# EAGLE schematic THESIS SCHEMATIC (EAGLE 9.7.0)
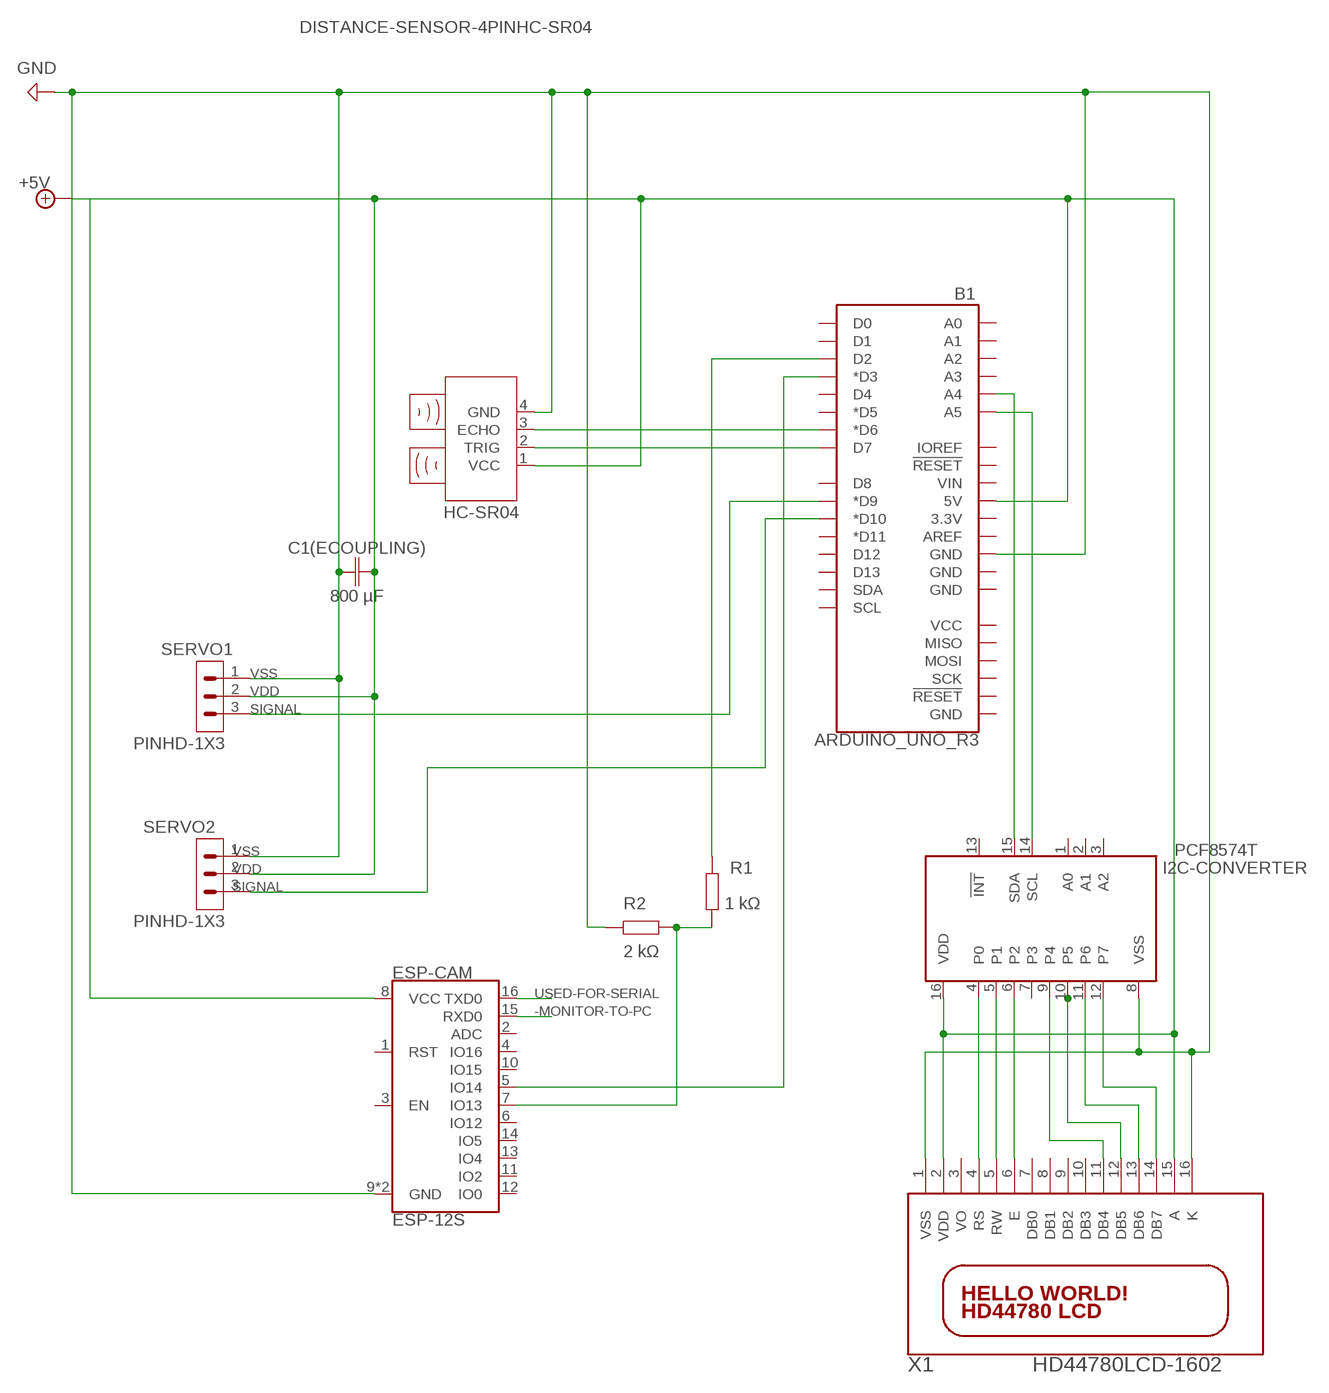
[diagram p0: schematic, sheet 1]

## Parts
B1  ARDUINO_UNO_R3  [ARDUINO_R3]
C1(ECOUPLING)  800 µF  C_RADIAL-12.5MM-DIA  [CAPRD550W60D1025H1250B]
ESP-CAM  ESP-12S  [ESP-12S]
HC-SR04  DISTANCE-SENSOR-4PINHC-SR04  [HC-SR04]
I2C-CONVERTER  PCF8574T  [SO16W]
R1  1 kΩ  R  (no package)
R2  2 kΩ  R  (no package)
SERVO1  PINHD-1X3  [1X03]
SERVO2  PINHD-1X3  [1X03]
X1  HD44780LCD-1602  [LCD1602]

## Nets
-MONITOR-TO-PC: ESP-CAM.15(RXD0)
N$1: B1.D7 HC-SR04.2(TRIG)
N$2: B1.D6(*D6) HC-SR04.3(ECHO)
N$3: B1.A5 I2C-CONVERTER.14(SCL)
N$4: I2C-CONVERTER.4(P0) X1.4(RS)
N$5: B1.D3(*D3) ESP-CAM.5(IO14)
N$6: B1.D2 R1.2
N$7: B1.A4 I2C-CONVERTER.15(SDA)
N$8: I2C-CONVERTER.5(P1) X1.5(RW)
N$9: ESP-CAM.7(IO13) R1.1 R2.2
N$10: I2C-CONVERTER.6(P2) X1.6(E)
N$11: I2C-CONVERTER.9(P4) X1.11(DB4)
N$12: I2C-CONVERTER.10(P5) X1.12(DB5)
N$13: I2C-CONVERTER.11(P6) X1.13(DB6)
N$14: I2C-CONVERTER.12(P7) X1.14(DB7)
N$15: ESP-CAM.8(VCC)
SIGNAL: B1.D9(*D9) B1.D10(*D10) SERVO1.3 SERVO2.3
USED-FOR-SERIAL: ESP-CAM.16(TXD0)
VDD: B1.5V C1(ECOUPLING).2 HC-SR04.1(VCC) I2C-CONVERTER.16(VDD) SERVO1.2 SERVO2.2 X1.2(VDD) X1.15(A) ; supply symbol labelled +5V
VSS: B1.GND@4(GND) C1(ECOUPLING).1 ESP-CAM.9(GND) ESP-CAM.P$1(GND) HC-SR04.4(GND) I2C-CONVERTER.8(VSS) R2.1 SERVO1.1 SERVO2.1 X1.1(VSS) X1.16(K) ; supply symbol labelled GND
Unconnected: B1.3.3V B1.A0 B1.A1 B1.A2 B1.A3 B1.AREF B1.D0 B1.D1 B1.D4 B1.D5(*D5) B1.D8 B1.D11(*D11) B1.D12 B1.D13 B1.GND@1(GND) B1.GND@2(GND) B1.GND@3(GND) B1.IOREF B1.MISO B1.MOSI B1.RESET@1(!RESET!) B1.RESET@2(!RESET!) B1.SCK B1.SCL B1.SDA B1.VCC B1.VIN ESP-CAM.1(RST) ESP-CAM.2(ADC) ESP-CAM.3(EN) ESP-CAM.4(IO16) ESP-CAM.6(IO12) ESP-CAM.10(IO15) ESP-CAM.11(IO2) ESP-CAM.12(IO0) ESP-CAM.13(IO4) ESP-CAM.14(IO5) I2C-CONVERTER.1(A0) I2C-CONVERTER.2(A1) I2C-CONVERTER.3(A2) I2C-CONVERTER.7(P3) I2C-CONVERTER.13(!INT) X1.3(VO) X1.7(DB0) X1.8(DB1) X1.9(DB2) X1.10(DB3)

## Library data of the parts
B1 = SparkFun-Boards:ARDUINO_UNO_R3: Arduino R3 Footprint with SPI header Arduino Uno R3 Compatible Footprint. Matches PCB size of the original board. SparkFun Products: SAMD21 Dev Breakout <https://www.sparkfun.com/products/13672> RedBoard <https://www.sparkfun.com/products/12757> R3 Stackable Headers <https://www.sparkfun.com/products/11417>
C1(ECOUPLING) = Capacitor:C: Capacitor - Generic; CATEGORY: Capacitor; PACKAGE_SIZE: 12.5MM-DIA; PACKAGE_TYPE: Through Hole; SUBCATEGORY: Aluminum Non-Polar Capacitors; TYPE: Radial Can
ESP-CAM = SparkFun-RF:ESP-12S: AI-Thinker ESP-12S ESP-12S WiFi module is developed by AI-Thinker Co.,Ltd, core processor ESP8266 in smaller sizes of the module encapsulates Tensilica L106 integrates industry-leading ultra low power 32-bit MCU micro, with the 16-bit short mode, clock speed support 80 MHz, 160 MHz, supports the RTOS, integrated Wi-Fi MAC/BB/RF/PA/LNA, on-board antennas.; PROD_ID: IC-14115
HC-SR04 = Tinkercad:DISTANCE-SENSOR-4PIN
I2C-CONVERTER = micro-philips:PCF8574: I2C-Bus Remote 8-bit I/O expander http://www.semiconductors.philips.com/acrobat_download/datasheets/PCF8574_4.pdf; MPN: PCF8574T/3,512; OC_FARNELL: 1201255; OC_NEWARK: 70R6870
R1 R2 = Ngspice-Simulation:R: RESISTOR
SERVO1 SERVO2 = Connector:PINHD-1X3: Pin Header; CATEGORY: Connectors; DESCRIPTION: Header-Straight-3 Position; PACKAGE_TYPE: Through Hole; PITCH: 0.100" (2.54mm); SUBCATEGORY: Headers; TYPE: Male Pins
X1 = adafruit:HD44780LCD: HD44780 LCD Standard character type LCDs, available in sizes from 8x1 to 40x4!